# EAGLE design SparkFun_Venus_GPS_SMA_Connector (EAGLE 7.4.0)
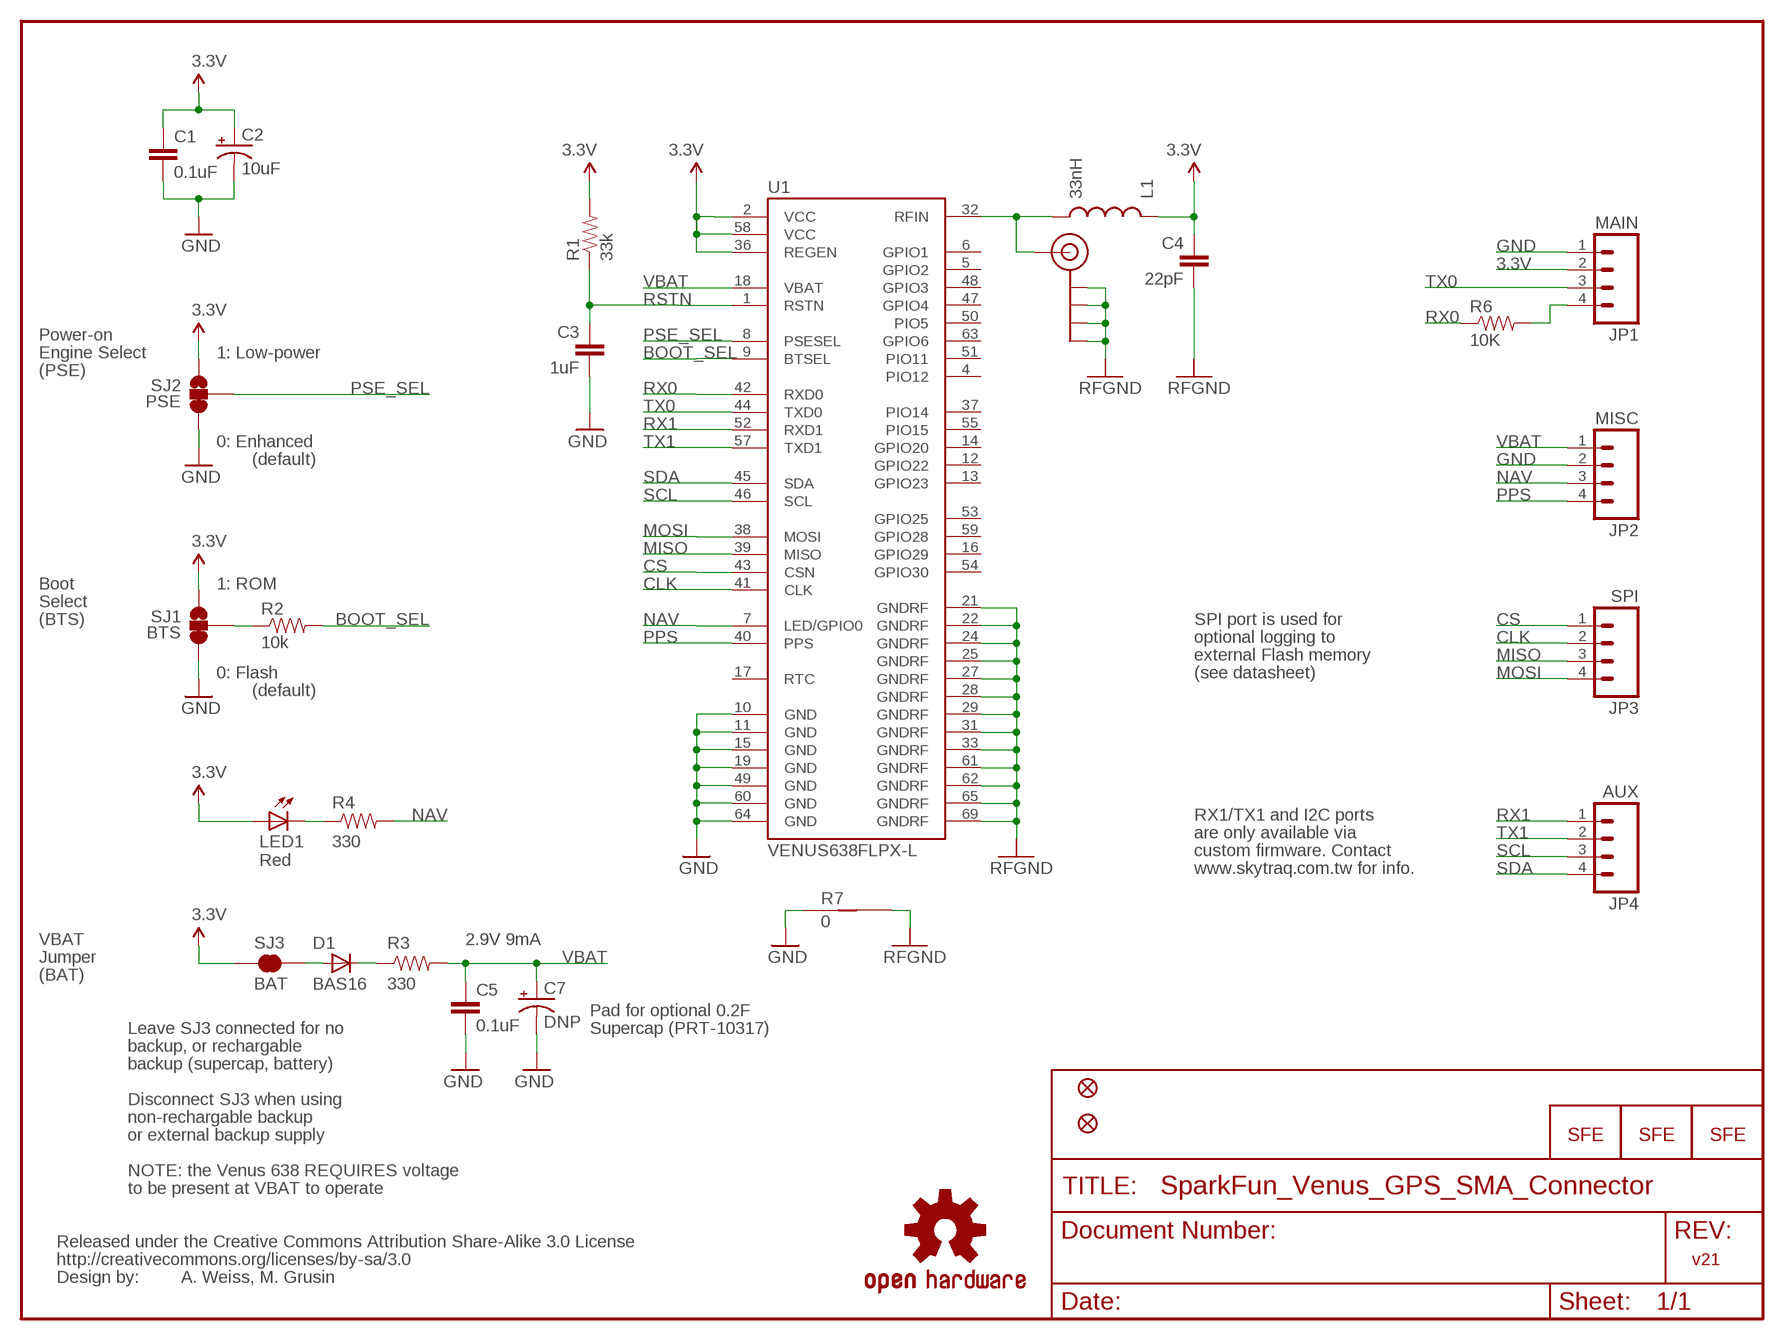
[diagram p0: schematic, sheet 1]

## Parts
C1  0.1uF  CAP0402-CAP  [0402-CAP]
C2  10uF  CAP_POL1206  [EIA3216]
C3  1uF  CAP0402-CAP  [0402-CAP]
C4  22pF  CAP0402-CAP  [0402-CAP]
C5  0.1uF  CAP0402-CAP  [0402-CAP]
C7  DNP  CAP_POLEN_J2  [EN_J2]
D1  BAS16  DIODESOD  [SOD-323]
JP1  MAIN  M04PTH  [1X04]
JP2  MISC  M04PTH  [1X04]
JP3  SPI  M04PTH  [1X04]
JP4  AUX  M04PTH  [1X04]
JP5  SMA_EDGE  [SMA-EDGE]
JP6  FIDUCIALUFIDUCIAL  [MICRO-FIDUCIAL]
JP7  FIDUCIALUFIDUCIAL  [MICRO-FIDUCIAL]
L1  33nH  INDUCTOR0402  [C0402]
LED1  Red  LED0603  [LED-0603]
LOGO1  LOGO-SFESK  [SFE-LOGO-FLAME]
LOGO2  LOGO-SFESK  [SFE-LOGO-FLAME]
LOGO3  LOGO-SFENW2  [SFE-NEW-WEB]
R1  33k  RESISTOR0402-RES  [0402-RES]
R2  10k  RESISTOR0402-RES  [0402-RES]
R3  330  RESISTOR0402-RES  [0402-RES]
R4  330  RESISTOR0402-RES  [0402-RES]
R6  10K  RESISTOR0402-RES  [0402-RES]
R7  0  GND-JUMP  [GND-JUMP]
SJ1  BTS  SOLDERJUMPER_2WAYPASTE2&3  [SJ_3_PASTE2&3]
SJ2  PSE  SOLDERJUMPER_2WAYPASTE2&3  [SJ_3_PASTE2&3]
SJ3  BAT  SOLDERJUMPERNC  [SJ_2S]
U1  VENUS638FLPX-L  [VENUS638FLPX]
U$4  OSHW-LOGOS  [OSHW-LOGO-S]
U$5  CREATIVE_COMMONS  [CREATIVE_COMMONS]

## Nets
3.3V: C1.1 C2.A(+) C4.1 JP1.2 L1.1 LED1.A R1.2 SJ1.1 SJ2.1 SJ3.1 U1.2(VCC) U1.36(REGEN) U1.58(VCC)
ANT: JP5.SIG(SIGNAL) L1.2 U1.32(RFIN)
BOOT_SEL: R2.2 U1.9(BTSEL)
CLK: JP3.2 U1.41(CLK)
CS: JP3.1 U1.43(CSN)
GND: C1.2 C2.C(-) C3.2 C5.2 C7.- JP1.1 JP2.2 R7.1 SJ1.3 SJ2.3 U1.10(GND) U1.11(GND) U1.15(GND) U1.19(GND) U1.49(GND) U1.60(GND) U1.64(GND)
MISO: JP3.3 U1.39(MISO)
MOSI: JP3.4 U1.38(MOSI)
N$1: LED1.C R4.1
N$2: R2.1 SJ1.2
N$3: D1.1(C) R3.1
N$6: D1.2(A) SJ3.2
NAV: JP2.3 R4.2 U1.7(LED/GPIO0)
PPS: JP2.4 U1.40(PPS)
PSE_SEL: SJ2.2 U1.8(PSESEL)
RFGND: C4.2 JP5.GND@0(GND) JP5.GND@1(GND) JP5.GND@2(GND) JP5.GND@3(GND) R7.2 U1.21(GNDRF) U1.22(GNDRF) U1.24(GNDRF) U1.25(GNDRF) U1.27(GNDRF) U1.28(GNDRF) U1.29(GNDRF) U1.31(GNDRF) U1.33(GNDRF) U1.61(GNDRF) U1.62(GNDRF) U1.65(GNDRF) U1.69(GNDRF)
RSTN: C3.1 R1.1 U1.1(RSTN)
RX0: R6.1 U1.42(RXD0)
RX1: JP4.1 U1.52(RXD1)
RX01: JP1.4 R6.2
SCL: JP4.3 U1.46(SCL)
SDA: JP4.4 U1.45(SDA)
TX0: JP1.3 U1.44(TXD0)
TX1: JP4.2 U1.57(TXD1)
VBAT: C5.1 C7.+ JP2.1 R3.2 U1.18(VBAT)
Unconnected: U1.4(PIO12) U1.5(GPIO2) U1.6(GPIO1) U1.12(GPIO22) U1.13(GPIO23) U1.14(GPIO20) U1.16(GPIO29) U1.17(RTC) U1.37(PIO14) U1.47(GPIO4) U1.48(GPIO3) U1.50(PIO5) U1.51(PIO11) U1.53(GPIO25) U1.54(GPIO30) U1.55(PIO15) U1.59(GPIO28) U1.63(GPIO6)

## Notes on the sheet
- Power-on
- Engine Select | 1: Low-power
- (PSE)
- RFGND | RFGND
- 0: Enhanced
- (default)
- Boot | 1: ROM
- Select
- (BTS) | SPI port is used for
- optional logging to
- external Flash memory
- 0: Flash | (see datasheet)
- (default)
- RX1/TX1 and I2C ports
- are only available via
- custom firmware. Contact
- RFGND | www.skytraq.com.tw for info.
- VBAT | 2.9V 9mA
- Jumper | RFGND
- (BAT)
- Pad for optional 0.2F
- Leave SJ3 connected for no | Supercap (PRT-10317)
- backup, or rechargable
- backup (supercap, battery)
- Disconnect SJ3 when using
- non-rechargable backup
- or external backup supply
- NOTE: the Venus 638 REQUIRES voltage
- to be present at VBAT to operate
- v21
- A. Weiss, M. Grusin

## Library data of the parts
C1 C3-C5 = SparkFun:CAP: Capacitor Standard 0603 ceramic capacitor, and 0.1" leaded capacitor.
C2 C7 = SparkFun:CAP_POL: Capacitor Polarized These are standard SMD and PTH capacitors. Normally 10uF, 47uF, and 100uF in electrolytic and tantalum varieties. Always verify the external diameter of the through hole cap, it varies with capacity, voltage, and manufacturer. The EIA devices should be standard.
D1 = SparkFun:DIODE: Diode These are standard reverse protection diodes and small signal diodes. SMA package can handle up to about 1A. SOD-323 can handle about 200mA. What the SOD-323 package when ordering, there are some mfgs out there that are 5-pin packages.
JP1-JP4 = SparkFun:M04: Header 4 Standard 4-pin 0.1" header. Use with straight break away headers (SKU : PRT-00116), right angle break away headers (PRT-00553), swiss pins (PRT-00743), machine pins (PRT-00117), and female headers (PRT-00115). Molex polarized connector foot print use with SKU : PRT-08231 with associated crimp pins and housings. 1MM SMD Version SKU: PRT-10208
JP5 = SparkFun:SMA_EDGE: SMA Antenna Connector End launch SMA connector. The paste layer has been removed so that the connector can be hand soldered onto the board after reflow.
JP6 JP7 = SparkFun:FIDUCIAL: Fiducial Alignment Points Various fiducial points for machine vision alignment.
L1 = SparkFun:INDUCTOR: Inductors Basic Inductor/Choke - 0603 and 1206. Footprints are not proven and vary greatly between part numbers.
LED1 = SparkFun:LED: LEDs Standard schematic elements and footprints for 5mm, 3mm, 1206, and 0603 sized LEDs. 5mm - Spark Fun Electronics SKU : COM-00529 (and others)
LOGO1-LOGO3 = SparkFun:LOGO-SFE: Spark Fun Electronics PCB Logo This is the standard Spark Fun Electronics PCB logo.
R1-R4 R6 = SparkFun:RESISTOR: Resistor Basic schematic elements and footprints for 0603, 1206, and PTH resistors.
R7 = mike-temp:GND-JUMP: Zero-Ohm trace for connecting different ground planes at a single point.
SJ1 SJ2 = SparkFun:SOLDERJUMPER_2WAY: Solder Jumper 2 way solder jumper
SJ3 = SparkFun:SOLDERJUMPER: Solder Jumper Standard SMD solder jumper. Used to automate production. Two varients : Normally Open and Normally Closed are the same, but have different paste layers. NC will have a large amount of paste and should jumper during reflow.
U1 = mike-temp:VENUS638FLPX-L: Venus638FLPX-L GPS Receiver Venus638FLPx is a high performance, low cost, single chip GPS receiver targeting mobile consumer and cellular handset applications. It offers very low power consumption, high sensitivity, and best in class signal acquisition and time-to-first-fix performance. Venus638FLPx contains all the necessary components of a complete GPS receiver, includes 1.2dB cascaded system NF RF front-end, GPS baseband signal processor, 0.5ppm TCXO, 32.768kHz RTC crystal, RTC LDO regulator, and passive components. It requires very low external component count and takes up only 100mm2 PCB footprint. Dedicated massive-correlator signal parameter search engine within the baseband enables rapid search of all the available satellites and acquisition of very weak signal. An advanced track engine allows weak signal tracking and positioning in harsh environments such as urban canyons and under deep foliage. The self-contained architecture keeps GPS processing off the host and allows integration into applications with very little resource. FEATURES 20Hz update rate -148dBm cold start sensitivity -165dBm tracking sensitivity 29 second cold start TTFF 3.5 second TTFF with AGPS 1 second hot start 2.5m accuracy Multipath detection and suppression Jamming detection and mitigation SBAS (WAAS / EGNOS) support 7-day extended ephemeris AGPS 67mW full power navigation Works directly with active or passive antenna Internal flash for optional 75K point data logging Supports external SPI flash memory data logging Complete receiver in 10mm x 10mm x 1.3mm size Contains LNA, SAW Filter, TCXO, RTC Xtal, LDO Pb-free RoHS compliant
U$4 = SparkFun:OSHW-LOGO: Open Source Hardware Logo This logo indicates the piece of hardware it is found on incorporates a OSHW license and/or adheres to the definition of open source hardware found here: http://freedomdefined.org/OSHW
U$5 = SparkFun:CREATIVE_COMMONS

## Board
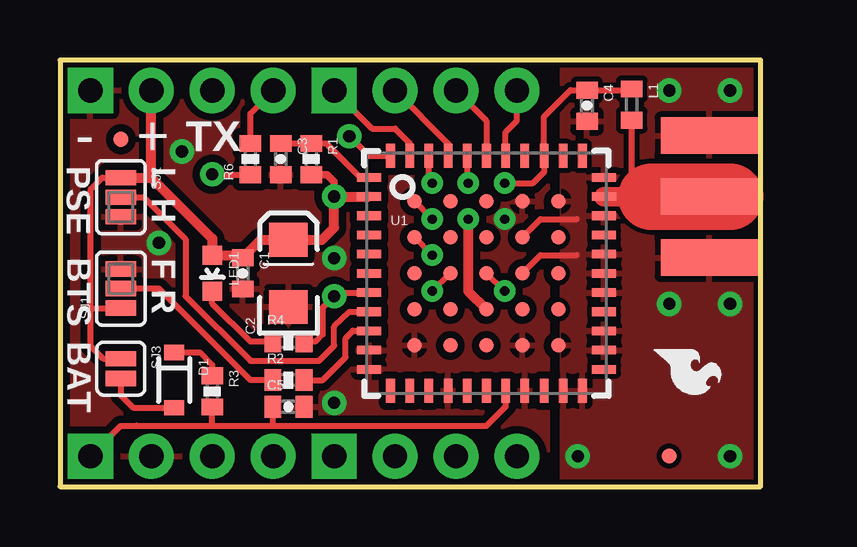
[diagram p1: board, top side]
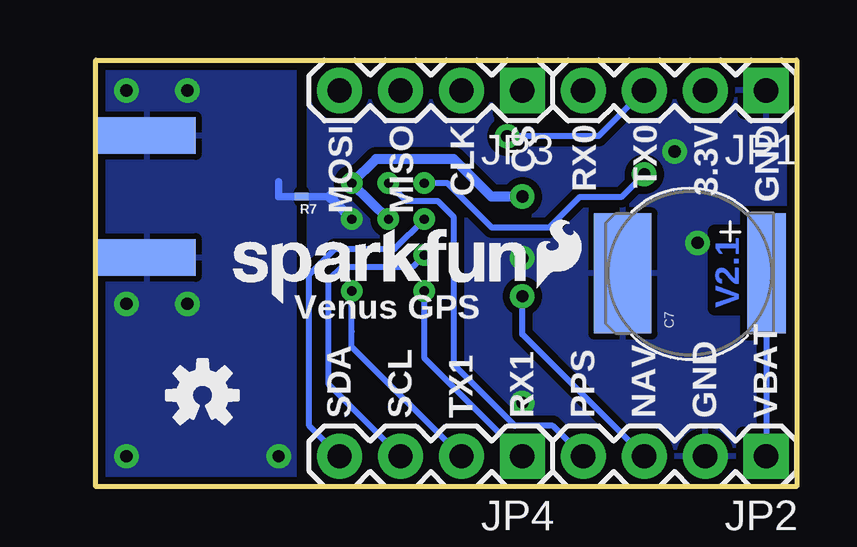
[diagram p2: board, bottom side, seen from below]

Size 29.21 x 17.78 mm. Coordinates in mm from the lower left corner, seen from the top.
Outline: 0,0 29.21,0 29.21,17.78 0,17.78 0,0
Copper layers (1*16): Top 0.035mm / dielectric 1.5mm / Bottom 0.035mm
Design rules "SparkFun-2-layer": minimum track width 7mil, minimum drill 15mil, track to track 8mil, track to pad 8mil, pad to pad 8mil, via to via 8mil, smd to smd 8mil, copper to edge 8mil, drill to drill 8mil, minimum pad ring 12mil, minimum via ring 10mil, stop-mask expansion 4mil, vias tented up to drill 20mil, thermal gap 10mil

### Footprints (pad centres in the part's own frame; a part is rotated, then mirrored left to right if it is on the bottom)
0402-CAP = smd 0.7 x 0.9: 1 -0.65,0; 2 0.65,0
EIA3216 = smd 1.4 x 1.6: A 1.4,0; C -1.4,0
EN_J2 = smd 5 x 1.6: + 0,-3.2 | smd 5 x 2.4: - 0,2.8
SOD-323 = smd 0.63 x 0.83: 1 -1.15,0; 2 1.15,0
1X04 = drill 1.016 pad 1.88 square: 1 0,0 | drill 1.016 pad 1.88: 2 2.54,0; 3 5.08,0; 4 7.62,0
SMA-EDGE = smd 1.524 x 4.064: GND@0 0,0; GND@1 5.08,0; SIG 2.54,0 | smd 1.524 x 4.064 bottom: GND@2 0,0; GND@3 5.08,0
MICRO-FIDUCIAL = smd 0.635 x 0.635: 1 0,0
C0402 = smd 0.7 x 0.9: 1 -0.65,0; 2 0.65,0
LED-0603 = smd 0.8 x 0.8: A 0,-0.75; C 0,0.75
0402-RES = smd 0.7 x 0.9: 1 -0.65,0; 2 0.65,0
GND-JUMP = smd 0.305 x 0.305: 1 -0.133,0; 2 0.133,0
SJ_3_PASTE2&3 = smd 0.635 x 1.27: 1 -0.813,0; 2 0,0; 3 0.813,0
SJ_2S = smd 0.635 x 1.27: 1 -0.412,0; 2 0.412,0
VENUS638FLPX = smd 1 x 0.36: 1 -4.9,4; 2 -4.9,3.2; 3 -4.9,2.4; 4 -4.9,1.6; 5 -4.9,0.8; 6 -4.9,0; 7 -4.9,-0.8; 8 -4.9,-1.6; 9 -4.9,-2.4; 10 -4.9,-3.2; 11 -4.9,-4; 23 4.9,-4; 24 4.9,-3.2; 25 4.9,-2.4; 26 4.9,-1.6; 27 4.9,-0.8; 28 4.9,0; 29 4.9,0.8; 30 4.9,1.6; 31 4.9,2.4; 32 4.9,3.2; 33 4.9,4 | smd 0.36 x 1: 12 -4,-4.9; 13 -3.2,-4.9; 14 -2.4,-4.9; 15 -1.6,-4.9; 16 -0.8,-4.9; 17 0,-4.9; 18 0.8,-4.9; 19 1.6,-4.9; 20 2.4,-4.9; 21 3.2,-4.9; 22 4,-4.9; 34 4,4.9; 35 3.2,4.9; 36 2.4,4.9; 37 1.6,4.9; 38 0.8,4.9; 39 0,4.9; 40 -0.8,4.9; 41 -1.6,4.9; 42 -2.4,4.9; 43 -3.2,4.9; 44 -4,4.9 | smd 0.6 x 0.6: 45 -3,3; 46 -3,1.5; 47 -3,0; 48 -3,-1.5; 49 -3,-3; 50 -1.5,3; 51 -1.5,1.5; 52 -1.5,0; 53 -1.5,-1.5; 54 -1.5,-3; 55 0,3; 56 0,1.5; 57 0,0; 58 0,-1.5; 59 0,-3; 60 1.5,3; 61 1.5,1.5; 62 1.5,0; 63 1.5,-1.5; 64 1.5,-3; 65 3,3; 66 3,1.5; 67 3,0; 68 3,-1.5; 69 3,-3

### Placement (x,y rotation side)
C1  7.62,8.89 270 top
C2  9.53,8.89 90 top
C3  9.21,13.65 270 top
C4  21.97,15.88 270 top
C5  9.53,3.33 0 top
C7  4.45,8.89 90 bottom
D1  4.76,4.45 270 top
JP1  1.27,16.51 180 bottom
JP2  1.27,1.27 180 bottom
JP3  11.43,16.51 180 bottom
JP4  11.43,1.27 180 bottom
JP5  27.08,9.55 90 top
JP6  25.4,1.27 0 top
JP7  2.54,14.48 0 top
L1  23.84,15.93 270 top
LED1  6.35,8.89 180 top
LOGO1  24.77,5.71 270 top
LOGO2  10.83,8.29 0 bottom
LOGO3  23.5,7.62 0 bottom
R1  10.48,13.65 270 top
R2  9.53,4.45 0 top
R3  6.35,3.97 270 top
R4  9.53,6.05 0 top
R6  7.94,13.65 90 top
R7  20.64,12.09 180 bottom
SJ1  2.54,8.26 90 top
SJ2  2.54,12.06 270 top
SJ3  2.54,4.92 270 top
U1  17.78,8.89 0 top
U$4  24.77,3.81 0 bottom
U$5  -15.24,-11.43 0 top  (outside the outline)

### Tracks (layer width: path | path; a pad name or v marks a point on that pad's centre or on a via)
3.3V  (via drill 0.38, 0.51)
  Top 0.254: SJ2.1 1.76,12.88 1.28,12.39 1.28,7.44 | U1.58 17.78,7.32 | v18.54,12.65 19.72,12.65 20.19,13.12 U1.36 20.18,15.42 20.32,15.56 21.29,16.52 C4.1 23.79,16.52 L1.1 | 1.28,7.44 SJ1.1 | 1.28,7.44 1.28,5.86 1.81,5.33 SJ3.1 | 7.52,9.64 C1.1
  Top 0.305: R1.2 11.13,13 11.43,12.7 v11.43,12.09
  Top 0.406: U1.58 17.02,8.15 v17.02,11.15 | SJ2.1 3.81,12.88 | 3.81,12.88 JP1.2 | U1.2 11.77,12.09 v11.43,12.09 11.43,10.79 10.93,10.29 C2.A 8.37,10.29 C1.1 | 7.52,9.64 LED1.A 6.35,10.34 3.81,12.88
  Bottom 0.406: v17.02,11.15 v18.54,12.65 17.54,13.65 14.29,13.65 12.72,12.09 v11.43,12.09
ANT
  Top 0.254: L1.2 23.84,12.38 24.13,12.09 | JP5.SIG
  Top 0.813: U1.32 24.13,12.09 24.66,12.09
  Top 2.769: 27.94,12.09 24.66,12.09 JP5.SIG
BOOT_SEL
  Top 0.254: U1.9 12.22,6.5 11.91,6.19 11.91,5.4 10.95,4.45 R2.2
CLK
  Top 0.254: U1.41 16.18,14.3 JP3.2
CS
  Top 0.254: U1.43 14.58,14.31 13.97,14.92 13.02,14.92 JP3.1
GND  (via drill 0.38, 0.51)
  Bottom 0.305: R7.1 19.28,12.09 U1.60
  Bottom 0.406: 19.48,12.09 U1.60 v18.54,11.15
  other vias: 4.13,10.16 11.43,9.53 11.43,3.49 5.08,13.97
  pour Bottom (isolate 0.305): 0,17.78 20.32,17.78 20.32,0 0,0
  pour Top (isolate 0.305): 0,17.78 20.32,17.78 20.32,0 0,0
MISO
  Top 0.254: U1.39 17.78,15.24 JP3.3
MOSI
  Top 0.254: U1.38 18.58,14.77 19.05,15.24 JP3.4
N$1
  Top 0.254: R4.1 7.94,6.04 6.35,7.63 LED1.C
N$2
  Top 0.254: SJ1.2 4.13,8.26 7.94,4.45 R2.1
N$3
  Top 0.254: D1.1 5.83,5.59 6.35,5.08 R3.1
N$6
  Top 0.254: D1.2 3.06,3.29 2.54,3.81 SJ3.2
NAV  (via drill 0.51)
  Top 0.254: R4.2 10.65,6.04 10.95,6.35 10.95,7.14 10.95,7.46 v11.43,7.94 11.58,8.09 U1.7
  Bottom 0.254: JP2.3 11.43,6.35 v11.43,7.94
PPS  (via drill 0.38)
  Top 0.254: U1.40 16.99,12.7 v17.02,12.65
  Bottom 0.254: JP2.4 10.16,2.54 11.75,2.54 14.29,5.08 14.29,11.23 14.95,11.9 16.27,11.9 v17.02,12.65
PSE_SEL
  Top 0.254: 12.06,7.29 11.43,6.68 11.43,5.87 10.79,5.24 7.94,5.24 5.24,7.94 5.24,10.32 3.49,12.06 SJ2.2 | 12.06,7.29 U1.8 | 12.06,7.29
RFGND  (via drill 0.51)
  Top 0.254: U1.61 20.04,11.15 21.54,11.15 | U1.62 20.04,9.65 21.54,9.65
  Bottom 0.305: R7.2 21.59,12.09 21.59,12.7
  other vias: 25.4,16.51 21.59,1.27 27.94,1.27 27.94,16.51 27.94,7.62 25.4,7.62
  pour Top: 20.95,17.78 20.95,0 29.21,0 29.21,17.78
  pour Bottom (isolate 0.305): 20.95,17.78 20.95,0 29.21,0 29.21,17.78
RSTN
  Top 0.254: C3.1 R1.1 11.1,14.3 12.51,12.89 U1.1
RX0  (via drill 0.38, 0.51)
  Top 0.254: U1.42 15.39,12.8 v15.52,12.65 | R6.1 6.37,13 v6.35,13.02
  Bottom 0.254: v15.52,12.65 14.55,12.65 12.7,10.79 10.32,10.79 9.05,12.06 7.3,12.06 v6.35,13.02
RX1  (via drill 0.38)
  Top 0.254: 16.2,8.89 U1.52 v15.52,8.15
  Bottom 0.254: v15.52,8.15 15.52,6.34 15.52,5.36 JP4.1
RX01
  Top 0.254: R6.2 7.94,15.56 JP1.4
SCL  (via drill 0.38)
  Top 0.254: v15.52,9.65 U1.46
  Bottom 0.254: JP4.3 19.51,4.27 19.51,8.64 18.97,9.18 16,9.18 v15.52,9.65
SDA  (via drill 0.38)
  Top 0.254: v15.52,11.15 U1.45
  Bottom 0.254: JP4.4 20.32,2.54 20.32,8.84 19.25,9.91 16.76,9.91 v15.52,11.15
TX0  (via drill 0.51)
  Top 0.254: U1.44 12.88,13.79 v12.06,14.61
  Bottom 0.254: v12.06,14.61 8.26,14.61 JP1.3
TX1  (via drill 0.38)
  Top 0.254: v18.54,8.15 U1.57
  Bottom 0.254: v18.54,8.15 18.54,6.48 18.54,5.84 JP4.2
VBAT
  Top 0.254: U1.18 18.59,3.35 17.78,2.54 8.89,2.54 | 3.17,2.54 2.54,2.54 JP2.1 | 3.17,2.54 6.35,2.54 | 6.35,2.54 8.89,2.54 | 6.35,2.54 R3.2 | 3.17,2.54 3.19,2.56 | C5.1 8.89,3.32 8.89,2.54
  Bottom 0.254: C7.+ 1.25,1.29 JP2.1

### Text on the board
Bottom: V2.1
tPlace: - | + | TX | PSE | L H | BTS | F R | BAT
bPlace: GND | 3.3V | TX0 | RX0 | CS | CLK | MISO | MOSI | Venus GPS | VBAT | GND | NAV | PPS | RX1 | TX1 | SCL | SDA
tValues: A. Weiss, M. Grusin
Document: 0.000" | 0.050" | 0.150" | 1.150" | 0.700" | 0.650" | 0.476" | 0.050" | 0.000" | 0.000"